# Altium schematic sheet SC945D_Afficheur.SchDoc: Afficheur
size 393 x 270 mm; CompanyName: Seccom; Address1: 521, rue du capt. François Garbit; Address2: 69440 Mornant; Address3: seccom@seccom.fr; Address4: www.seccom.fr; DocumentNumber: 9; SheetNumber: 9; SheetTotal: 9; PageSetup: Record=PageOptions|CenterHorizontal=True|CenterVertical=True|PrintScale=0.74|XCorrection=1.00|YCorrection=1.00|PrintKind=0|BorderSize=5000000|LeftOffset=0|BottomOffset=0|Orientation=2|PaperLength=1000|PaperWidth=1000|Scale=100|PaperSource=7|PrintQuality=-4|MediaType=1|DitherType=10|PaperKind=A4|PrintScaleMode=1
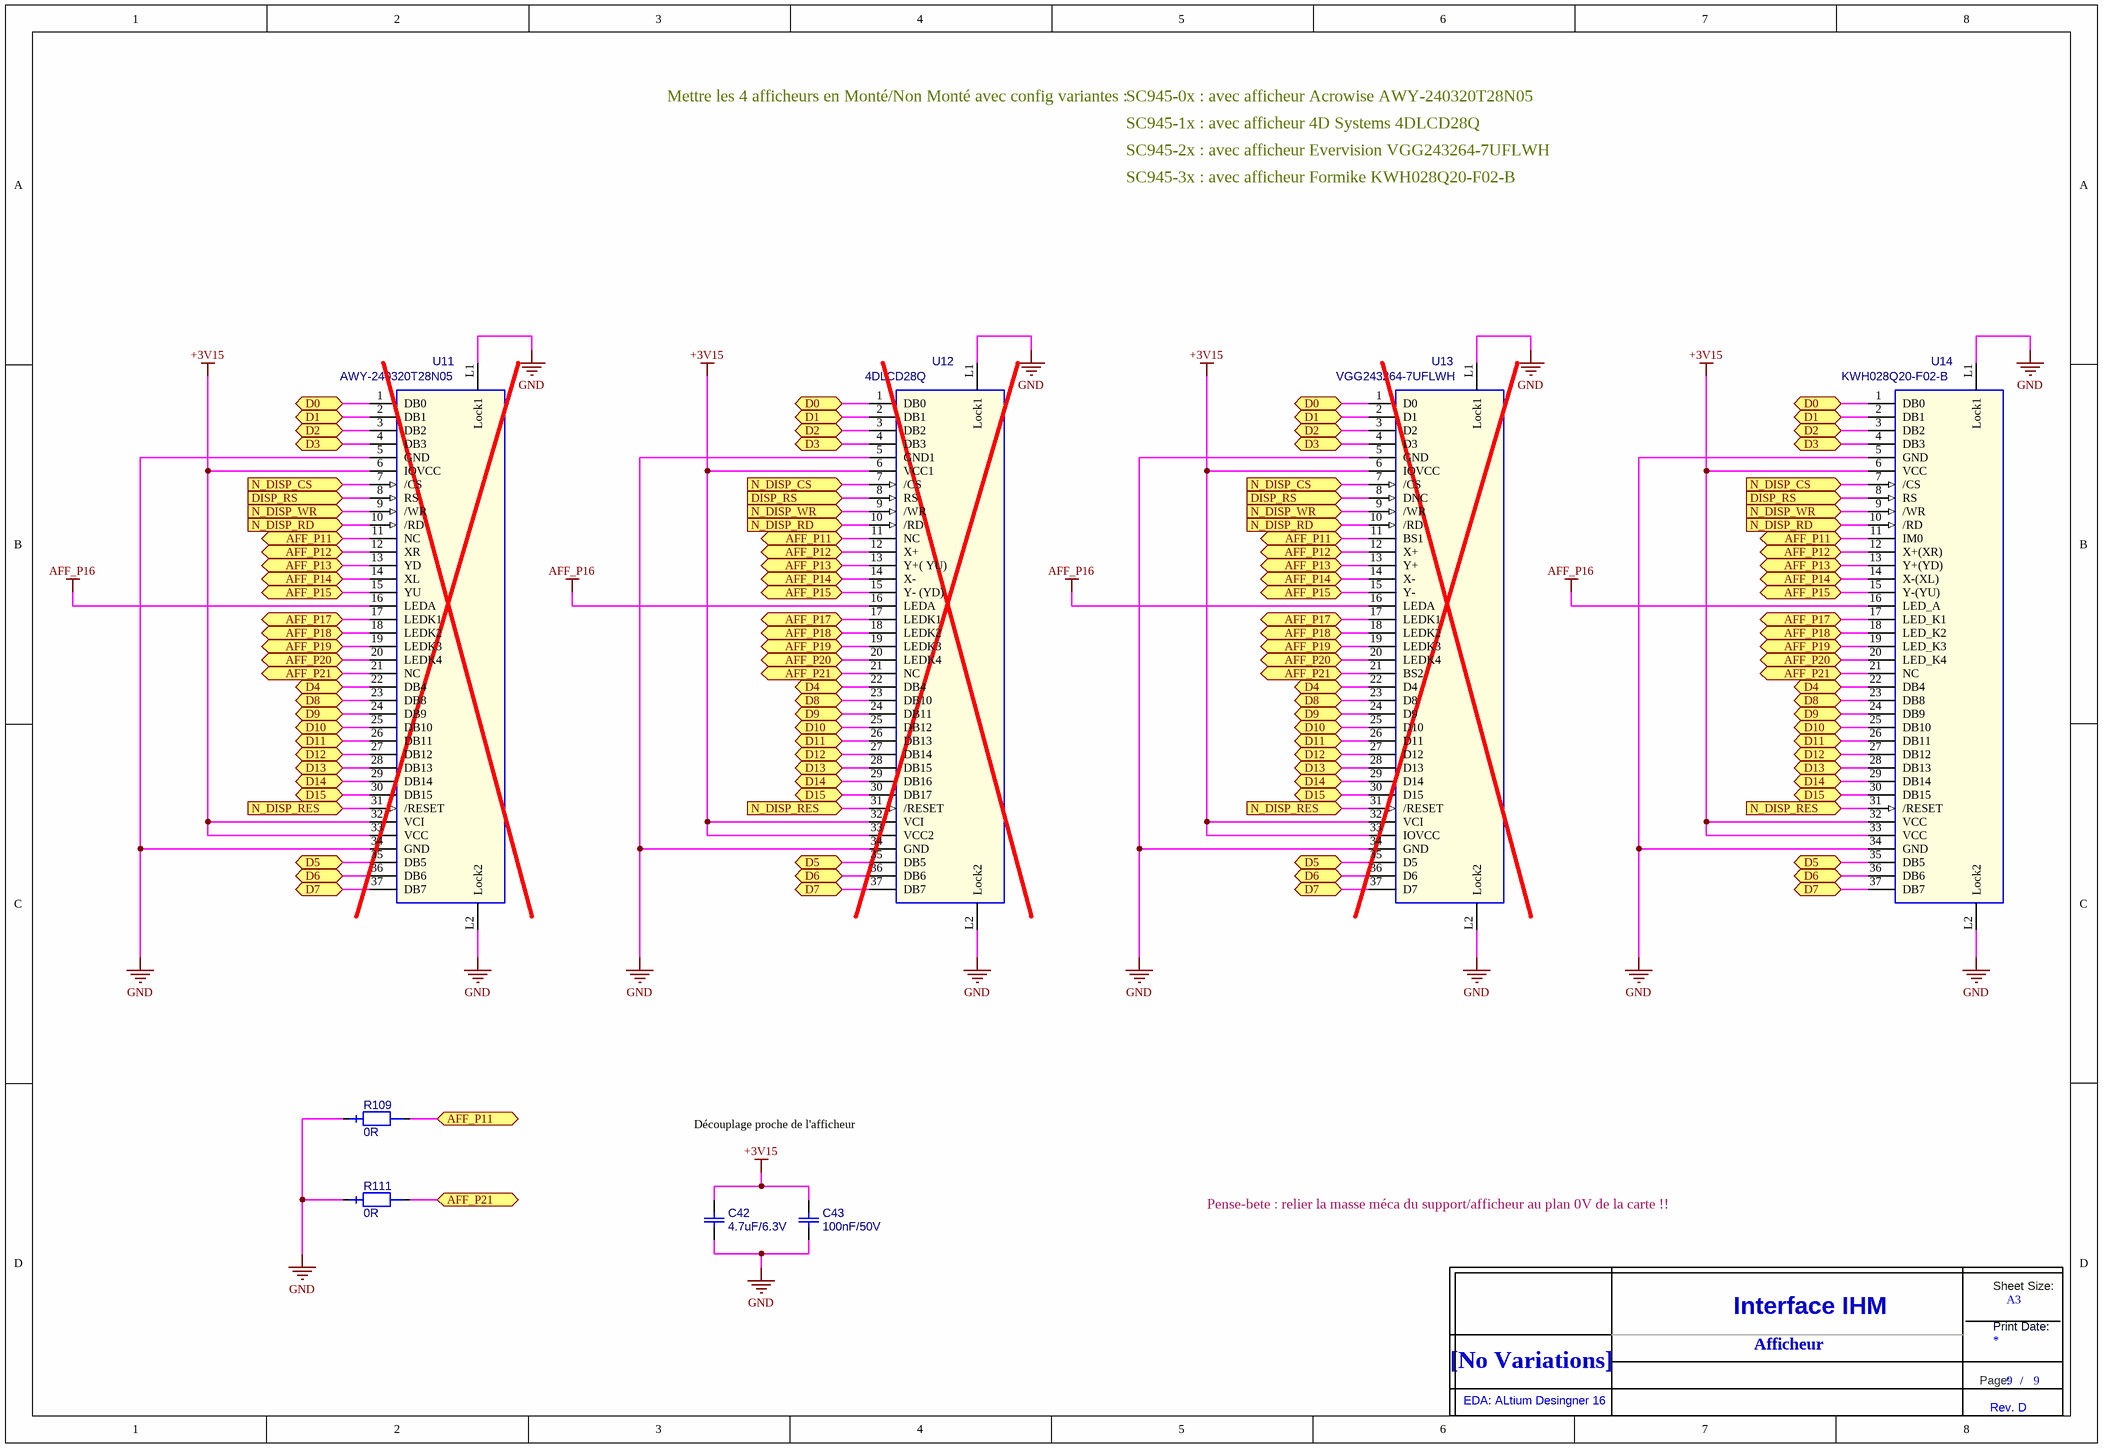
[diagram p0: SC945D_Afficheur.SchDoc]

## Parts
C42  value 4.7uF/6.3V  [0603_ReflowSoldering_CAP]  (hidden comment: C_0603_X5R_10%_4.7U-6.3V)
C43  value 100nF/50V  [0603_ReflowSoldering_CAP]  (hidden comment: C_0603_X7R_10%_100N-50V)
R109  value 0R  [0603_ReflowSoldering_RES]  (hidden comment: RES_0603_1%_100PPM_0R)
R111  value 0R  [0603_ReflowSoldering_RES]  (hidden comment: RES_0603_1%_100PPM_0R)
Title_new?  DNI  (value not drawn)  (graphical)
U11  value AWY-240320T28N05  [AFFICHEUR_50x69.2_FPC37_e1MM]  (hidden comment: AFFICHEUR_AWY-240320T28N05)  (no BOM)
U12  value 4DLCD28Q  [AFFICHEUR_50x69.2_FPC37_e1MM]  (hidden comment: AFFICHEUR_4DLCD28Q)  (no BOM)
U13  value VGG243264-7UFLWH  [AFFICHEUR_50x69.2_FPC37_e1MM]  (hidden comment: AFFICHEUR_VGG243264-7UFLWH)  (no BOM)
U14  value KWH028Q20-F02-B  [AFFICHEUR_50x69.2_FPC37_e1MM]  (hidden comment: AFFICHEUR_KWH028Q20_F02_B)

## Ports
AFF_P11 (bidir), AFF_P12 (bidir), AFF_P13 (bidir), AFF_P14 (bidir), AFF_P15 (bidir), AFF_P17 (bidir), AFF_P18 (bidir), AFF_P19 (bidir), AFF_P20 (bidir), AFF_P21 (bidir), D0 (bidir), D1 (bidir), D2 (bidir), D3 (bidir), D4 (bidir), D5 (bidir), D6 (bidir), D7 (bidir), D8 (bidir), D9 (bidir), D10 (bidir), D11 (bidir), D12 (bidir), D13 (bidir), D14 (bidir), D15 (bidir), DISP_RS (in), N_DISP_CS (in), N_DISP_RD (in), N_DISP_RES (in), N_DISP_WR (in)

## Nets
+3V15: C42.2 C43.2 U11.6(IOVCC) U11.32(VCI) U11.33(VCC) U12.6(VCC1) U12.32(VCI) U12.33(VCC2) U13.6(IOVCC) U13.32(VCI) U13.33(IOVCC) U14.6(VCC) U14.32(VCC) U14.33(VCC)
AFF_P16: U11.16(LEDA) U12.16(LEDA) U13.16(LEDA) U14.16(LED_A)
GND: C42.1 C43.1 R109.1 R111.1 U11.5(GND) U11.34(GND) U11.L1(Lock1) U11.L2(Lock2) U12.5(GND1) U12.34(GND) U12.L1(Lock1) U12.L2(Lock2) U13.5(GND) U13.34(GND) U13.L1(Lock1) U13.L2(Lock2) U14.5(GND) U14.34(GND) U14.L1(Lock1) U14.L2(Lock2)
AFF_P11: R109.2 U11.11(NC) U12.11(NC) U13.11(BS1) U14.11(IM0) ; port AFF_P11
AFF_P12: U11.12(XR) U12.12(X+) U13.12(X+) U14.12(X+(XR)) ; port AFF_P12
AFF_P13: U11.13(YD) U12.13(Y+(_YU)) U13.13(Y+) U14.13(Y+(YD)) ; port AFF_P13
AFF_P14: U11.14(XL) U12.14(X-) U13.14(X-) U14.14(X-(XL)) ; port AFF_P14
AFF_P15: U11.15(YU) U12.15(Y-_(YD)) U13.15(Y-) U14.15(Y-(YU)) ; port AFF_P15
AFF_P17: U11.17(LEDK1) U12.17(LEDK1) U13.17(LEDK1) U14.17(LED_K1) ; port AFF_P17
AFF_P18: U11.18(LEDK2) U12.18(LEDK2) U13.18(LEDK2) U14.18(LED_K2) ; port AFF_P18
AFF_P19: U11.19(LEDK3) U12.19(LEDK3) U13.19(LEDK3) U14.19(LED_K3) ; port AFF_P19
AFF_P20: U11.20(LEDK4) U12.20(LEDK4) U13.20(LEDK4) U14.20(LED_K4) ; port AFF_P20
AFF_P21: R111.2 U11.21(NC) U12.21(NC) U13.21(BS2) U14.21(NC) ; port AFF_P21
D0: U11.1(DB0) U12.1(DB0) U13.1(D0) U14.1(DB0) ; port D0
D1: U11.2(DB1) U12.2(DB1) U13.2(D1) U14.2(DB1) ; port D1
D2: U11.3(DB2) U12.3(DB2) U13.3(D2) U14.3(DB2) ; port D2
D3: U11.4(DB3) U12.4(DB3) U13.4(D3) U14.4(DB3) ; port D3
D4: U11.22(DB4) U12.22(DB4) U13.22(D4) U14.22(DB4) ; port D4
D5: U11.35(DB5) U12.35(DB5) U13.35(D5) U14.35(DB5) ; port D5
D6: U11.36(DB6) U12.36(DB6) U13.36(D6) U14.36(DB6) ; port D6
D7: U11.37(DB7) U12.37(DB7) U13.37(D7) U14.37(DB7) ; port D7
D8: U11.23(DB8) U12.23(DB10) U13.23(D8) U14.23(DB8) ; port D8
D9: U11.24(DB9) U12.24(DB11) U13.24(D9) U14.24(DB9) ; port D9
D10: U11.25(DB10) U12.25(DB12) U13.25(D10) U14.25(DB10) ; port D10
D11: U11.26(DB11) U12.26(DB13) U13.26(D11) U14.26(DB11) ; port D11
D12: U11.27(DB12) U12.27(DB14) U13.27(D12) U14.27(DB12) ; port D12
D13: U11.28(DB13) U12.28(DB15) U13.28(D13) U14.28(DB13) ; port D13
D14: U11.29(DB14) U12.29(DB16) U13.29(D14) U14.29(DB14) ; port D14
D15: U11.30(DB15) U12.30(DB17) U13.30(D15) U14.30(DB15) ; port D15
DISP_RS: U11.8(RS) U12.8(RS) U13.8(DNC) U14.8(RS) ; port DISP_RS
N_DISP_CS: U11.7(/CS) U12.7(/CS) U13.7(/CS) U14.7(/CS) ; port N_DISP_CS
N_DISP_RD: U11.10(/RD) U12.10(/RD) U13.10(/RD) U14.10(/RD) ; port N_DISP_RD
N_DISP_RES: U11.31(/RESET) U12.31(/RESET) U13.31(/RESET) U14.31(/RESET) ; port N_DISP_RES
N_DISP_WR: U11.9(/WR) U12.9(/WR) U13.9(/WR) U14.9(/WR) ; port N_DISP_WR

## Notes on the sheet
- Mettre les 4 afficheurs en Monté/Non Monté avec config variantes :
- SC945-0x : avec afficheur Acrowise AWY-240320T28N05
- SC945-1x : avec afficheur 4D Systems 4DLCD28Q
- SC945-2x : avec afficheur Evervision VGG243264-7UFLWH
- SC945-3x : avec afficheur Formike KWH028Q20-F02-B
- Découplage proche de l'afficheur
- Pense-bete : relier la masse méca du support/afficheur au plan 0V de la carte !!
- Afficheur
- (in symbol Title_new) Sheet Size:; A3; Interface IHM; Print Date:; [No Variations]; Page:; /; EDA: ALtium Desingner 16; Rev. D

## Library data of the parts
C42 = C_0603_X5R_10%_4.7U-6.3V: Condensateur céramique, X5R, 10%, CMS 0603, 4.7uF/6.3V; Creation: FB (29/02/12); Boitier: 0603; Remarque: {Remarque}; Fabricant: Kemet; Ref Fab: C0603C475K9PAC; Coeff: 1; ComponentLink1URL: O:\_Documentation\Datasheets\Kemet\Condos_Ceramic_X5R.pdf; ComponentLink2URL: o:\_Documentation\Datasheets\_BOITIERS\PASSIF_CMS\; Config: *; ComponentLink1Description: Datasheet; ComponentLink2Description: Datasheet Boitier; Supplier 1: Farnell; Supplier 2: RadioSpares; Supplier Part Number 1: 9227784; Supplier Part Number 2: 6911164
C43 = C_0603_X7R_10%_100N-50V: Condensateur céramique, X7R, 10%, CMS 0603, 100nF/50V; Creation: FB (29/02/12); Boitier: 0603; Remarque: {Remarque}; Fabricant: Kemet; Ref Fab: C0603C104K5RAC; Coeff: 1; ComponentLink1URL: O:\_Documentation\Datasheets\Kemet\Condos_Ceramic_CMS.pdf; ComponentLink2URL: o:\_Documentation\Datasheets\_BOITIERS\PASSIF_CMS\; Config: *; ComponentLink1Description: Datasheet; ComponentLink2Description: Datasheet Boitier; Supplier 1: Farnell; Supplier Part Number 1: 1288255
R109 R111 = RES_0603_1%_100PPM_0R: Résistance, 0.100W, 1%, 100ppm, 75V, 0R; Creation: FB (04/07/12); Boitier: 0603; Remarque: {Remarque}; Fabricant: Vishay; Ref Fab: CRCW06030000Z0EA; Coeff: 1; Verification: *; ComponentLink1URL: O:\_Documentation\Datasheets\Vishay\Resistances_D-CRCWe3.pdf; ComponentLink2URL: o:\_Documentation\Datasheets\_BOITIERS\PASSIF_CMS\; Config: *; ComponentLink1Description: Datasheet; ComponentLink2Description: Datasheet Boitier; Supplier 1: Farnell; Supplier Part Number 1: 1469739
Title_new? = Title_new
U11 = AFFICHEUR_AWY-240320T28N05: Afficheur tactile, TFT, taille 2.8p, 240x320p, bus CPU 16 bits, dale résistive 4 fils, backlight 4 Leds, nappe à souder 37pts pas 1mm; Creation: PDP (11/07/12); Boitier: 50x69.2_h2.5mm_FPC37_e1mm; Remarque: {Remarque}; Coeff: 1; Fabricant: Acrowise; ComponentLink1URL: O:\_Documentation\Datasheets\Acrowise\AWY-240320T28N05_datasheet.pdf; ComponentLink2URL: O:\_Documentation\Datasheets\Acrowise\AWY-240320T28N05_Plan coté.pdf; Config: *; ComponentLink1Description: Datasheet; ComponentLink2Description: Datasheet Boitier; Ref Fab: AWY-240320T28N05
U12 = AFFICHEUR_4DLCD28Q: Afficheur tactile, TFT, taille 2.8p, 240x320p, bus CPU 16 bits, dale résistive 4 fils, backlight 4 Leds, nappe à souder 37pts pas 1mm; Creation: FB (13/09/12); Boitier: 50x69.2_h4.1mm_FPC37_e1mm; Remarque: {Remarque}; Coeff: 1; Fabricant: 4D Systems; ComponentLink1URL: O:\_Documentation\Datasheets\4D_Systems\4DLCD28Q_datasheet.pdf; ComponentLink2URL: O:\_Documentation\Datasheets\4D_Systems\4DLCD28Q_Dimensions.pdf; Config: *; ComponentLink1Description: Datasheet; ComponentLink2Description: Datasheet Boitier; Ref Fab: 4DLCD28Q
U13 = AFFICHEUR_VGG243264-7UFLWH: Afficheur tactile, TFT, taille 2.8p, 240x320p, bus CPU 16 bits, dale résistive 4 fils, backlight 4 Leds, nappe à souder 37pts pas 1mm; Creation: FB (13/09/12); Boitier: 50x69.2_h4.2mm_FPC37_e1mm; Remarque: {Remarque}; Coeff: 1; Fabricant: Evervision; ComponentLink1URL: O:\_Documentation\Datasheets\Evervision\VGG243264-7UFLWH_datasheet.pdf; Config: *; ComponentLink1Description: Datasheet; ComponentLink2Description: Datasheet Boitier; Ref Fab: VGG243264-7UFLWH
U14 = AFFICHEUR_KWH028Q20_F02_B: Afficheur tactile, TFT, taille 2.8p, 240x320p, bus CPU 16 bits, dale résistive 4 fils, backlight 4 Leds, nappe à souder 37pts pas 1mm; Creation: ZA (30/07/13); Boitier: 50x69.2_h3.6mm_FPC37_e1mm; Remarque: Active area de  43.2x57.6mm; Coeff: 1; Fabricant: Formike Electronic; ComponentLink1URL: O:\_Documentation\Datasheets\Formike_Electronic\KWH028Q20-F02-B_datasheet.PDF; Config: *; ComponentLink1Description: Datasheet; ComponentLink2Description: Datasheet Boitier; Ref Fab: KWH028Q20-F02-B